# Altium schematic sheet 301_GridPos3.SchDoc
size A2; Organization: Greenfield Tech Solutions; Address1: Molendreef 33; Address2: Ossendrecht; Address3: 4641CS; Address4: The Netherlands; SheetNumber: 3; SheetTotal: 7
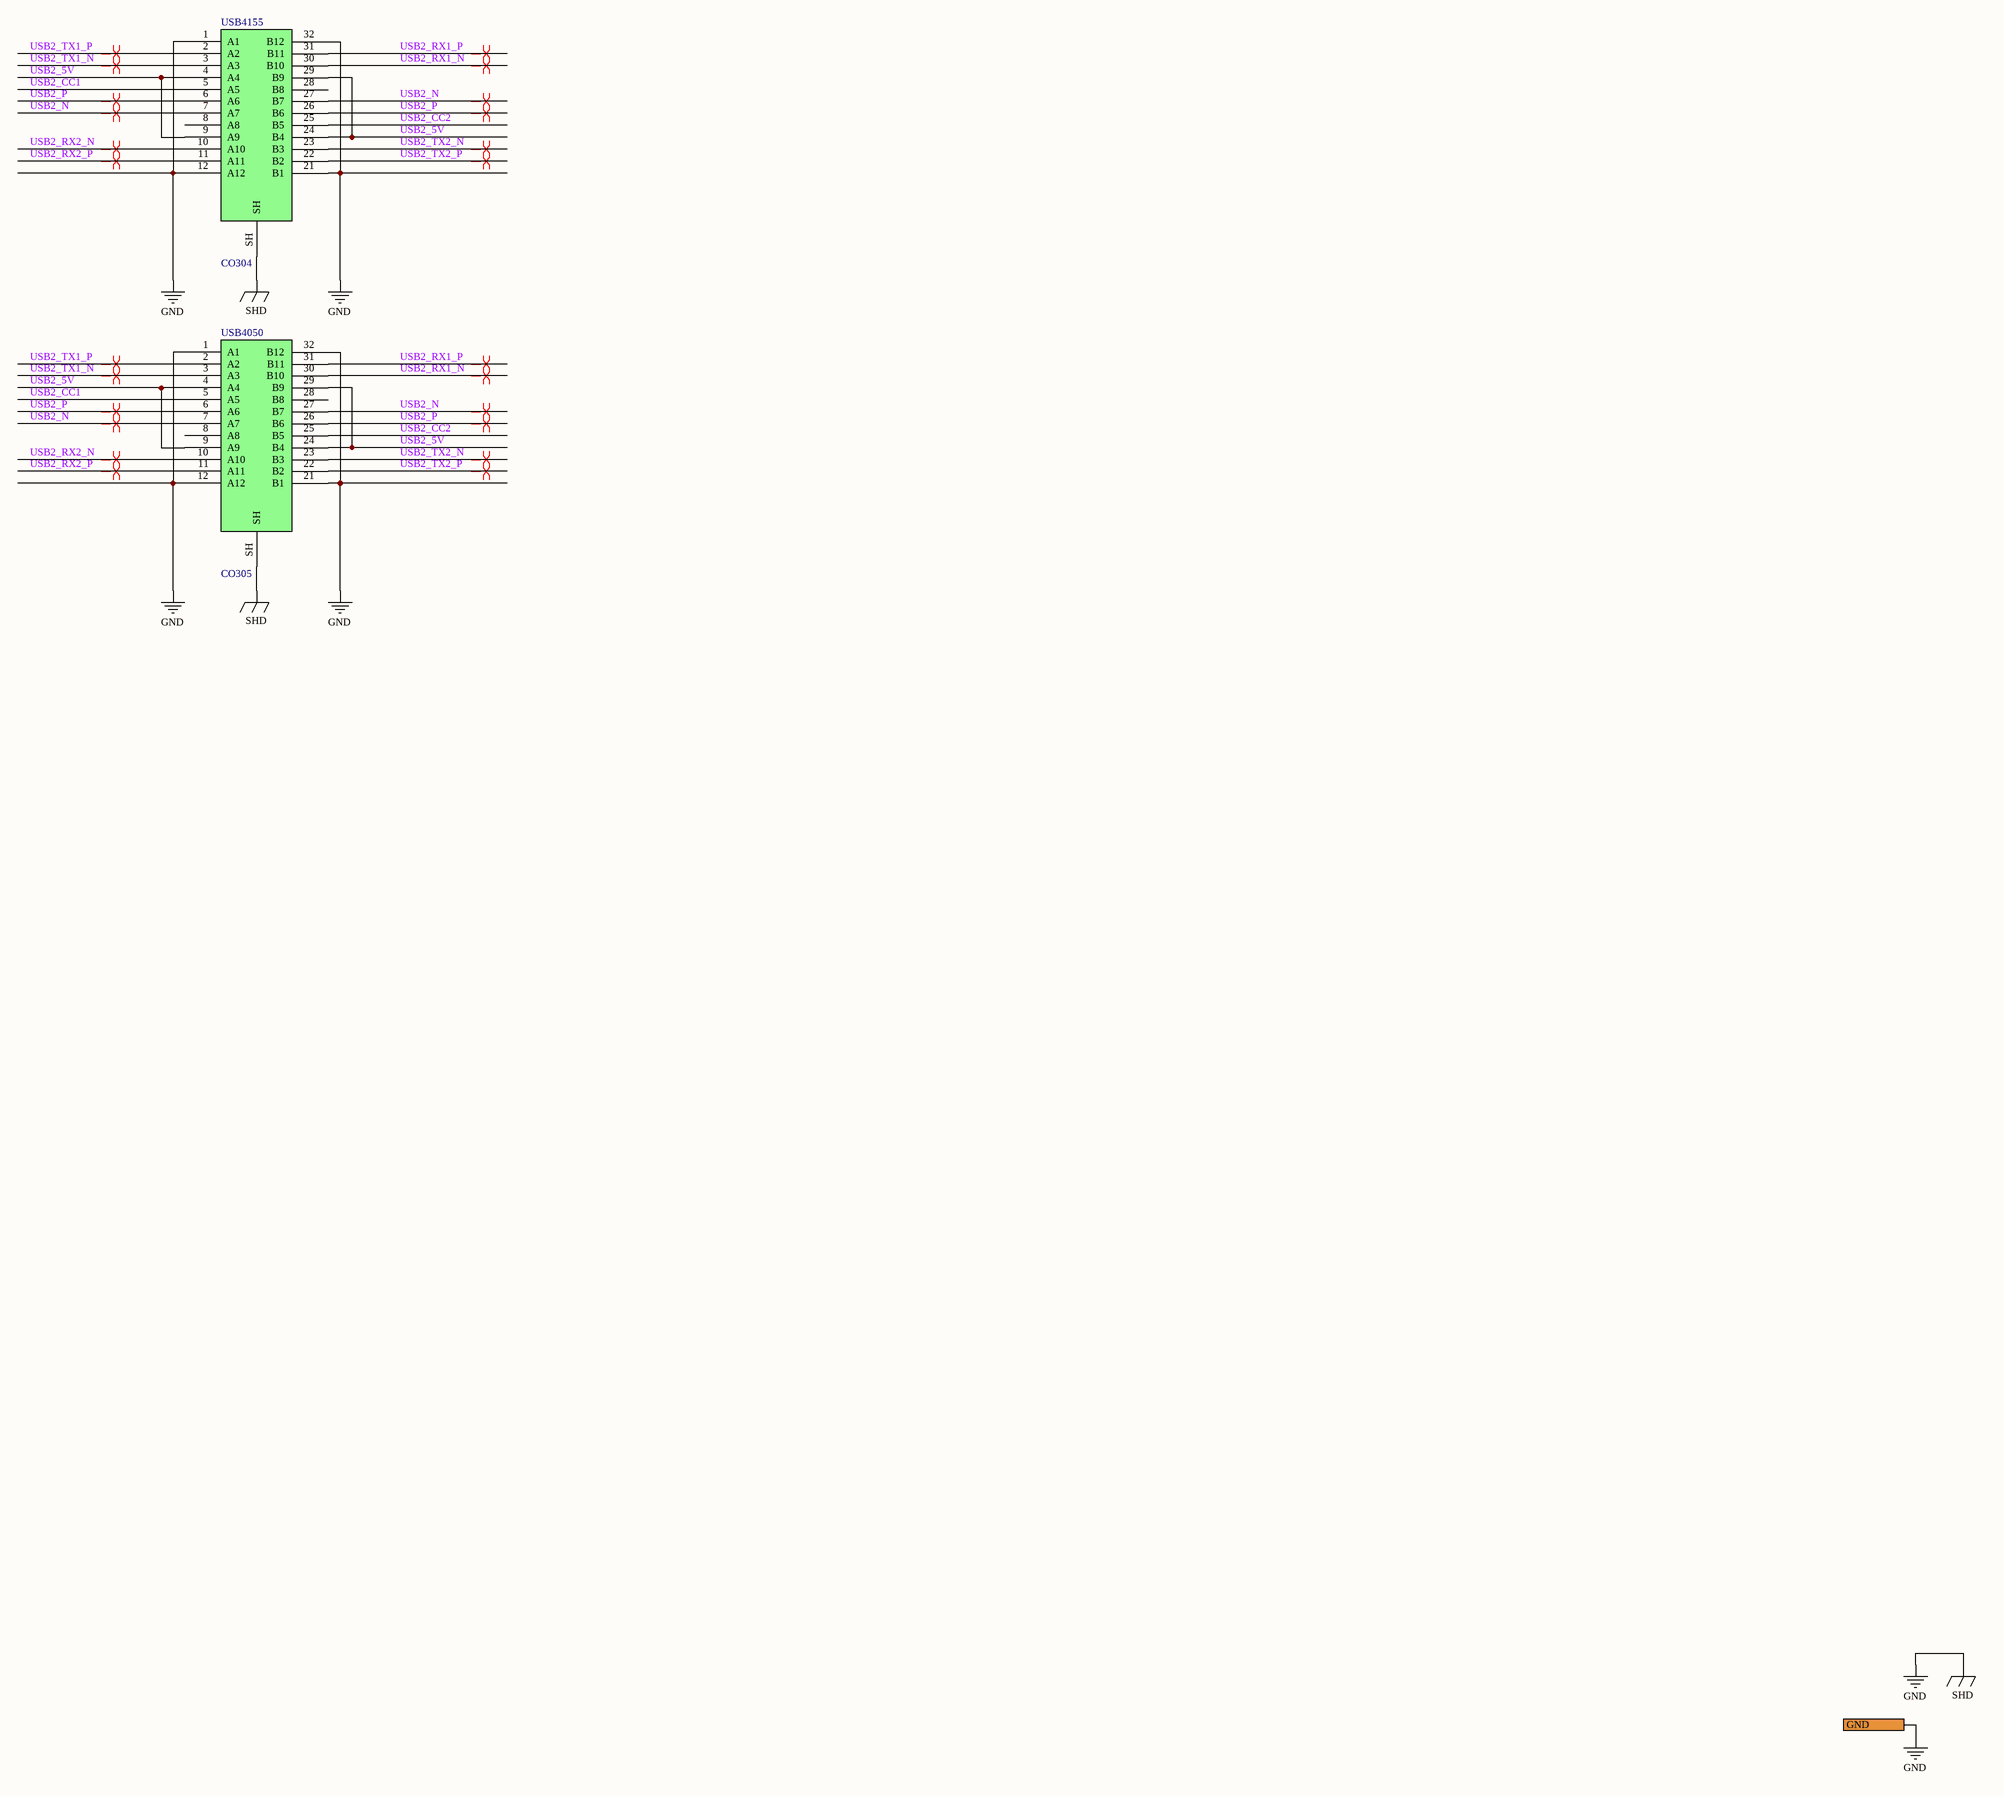
[diagram p0: 301_GridPos3.SchDoc]

## Parts
CO304  USB4155  [USB4155-03-C]
CO305  USB4050  [USB4050-30-A]

## Ports
GND

## Nets
GND: CO304.1(A1) CO304.12(A12) CO304.21(B1) CO304.32(B12) CO304.SH CO305.1(A1) CO305.12(A12) CO305.21(B1) CO305.32(B12) CO305.SH ; port GND  [also labelled SHD]
USB2_5V: CO304.4(A4) CO304.9(A9) CO304.24(B4) CO304.29(B9) CO305.4(A4) CO305.9(A9) CO305.24(B4) CO305.29(B9)
USB2_CC1: CO304.5(A5) CO305.5(A5)
USB2_CC2: CO304.25(B5) CO305.25(B5)
USB2_N: CO304.7(A7) CO304.27(B7) CO305.7(A7) CO305.27(B7)
USB2_P: CO304.6(A6) CO304.26(B6) CO305.6(A6) CO305.26(B6)
USB2_RX1_N: CO304.30(B10) CO305.30(B10)
USB2_RX1_P: CO304.31(B11) CO305.31(B11)
USB2_RX2_N: CO304.10(A10) CO305.10(A10)
USB2_RX2_P: CO304.11(A11) CO305.11(A11)
USB2_TX1_N: CO304.3(A3) CO305.3(A3)
USB2_TX1_P: CO304.2(A2) CO305.2(A2)
USB2_TX2_N: CO304.23(B3) CO305.23(B3)
USB2_TX2_P: CO304.22(B2) CO305.22(B2)

Not connected (* = marked no-connect by the designer): CO304 8(A8) 28(B8); CO305 8(A8) 28(B8)

## Layout directives
differential pair; differential pair class USB3: USB2_N, USB2_P, USB2_RX1_N, USB2_RX1_P, USB2_RX2_N, USB2_RX2_P, USB2_TX1_N, USB2_TX1_P, USB2_TX2_N, USB2_TX2_P

## Notes on the sheet
- Title
- Size:
- Date:
- File:
- A2
- Number:
- Time:
- Revision:
- Sheet
- of

## Library data of the parts
CO304 = CO0031: USB C connector Plug Horizontal; Part Number: CO0031; ID: 30; RefVal: USB4155; ManfactPart: USB4155-03-C
CO305 = CO0039: USB C connector Receptacle Horizontal; Part Number: CO0039; ID: 39; RefVal: USB4050; ManfactPart: USB4050-30-A